# EAGLE design AudioProcessor (EAGLE 8.3.2)

## Sheet 1 of 2
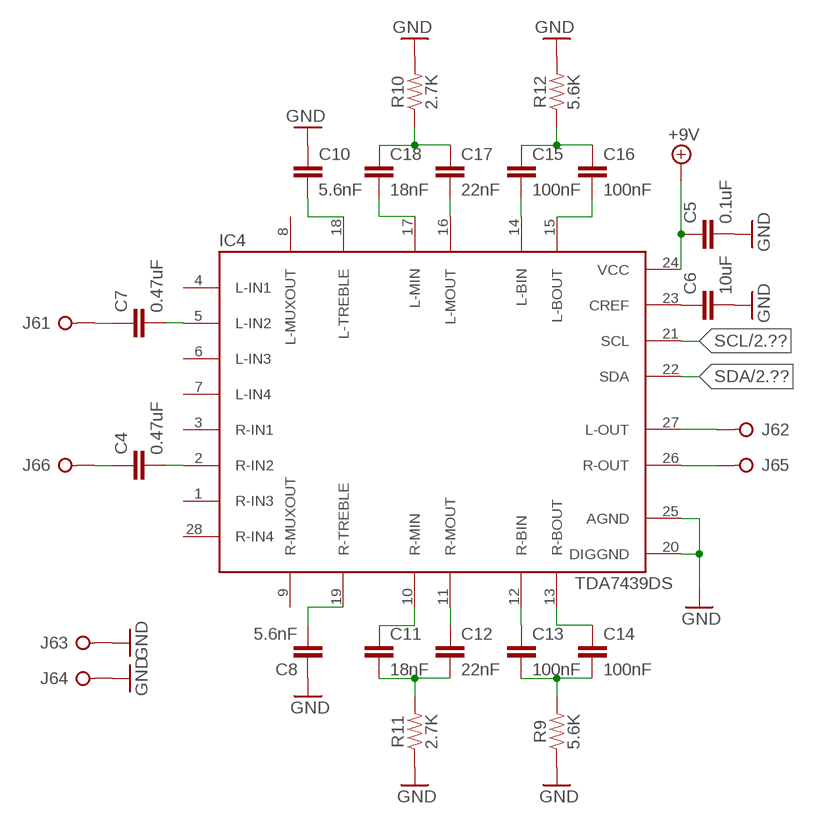
[diagram p0: schematic, sheet 1]

### Parts
C4  0.47uF  CAPACITOR-5MM  [CAPACITOR-5MM]
C5  0.1uF  CAPACITOR-0603  [CAPACITOR-0603]
C6  10uF  CAPACITOR-1206  [CAPACITOR-1206]
C7  0.47uF  CAPACITOR-5MM  [CAPACITOR-5MM]
C8  5.6nF  CAPACITOR-5MM  [CAPACITOR-5MM]
C10  5.6nF  CAPACITOR-5MM  [CAPACITOR-5MM]
C11  18nF  CAPACITOR-5MM  [CAPACITOR-5MM]
C12  22nF  CAPACITOR-5MM  [CAPACITOR-5MM]
C13  100nF  CAPACITOR-5MM  [CAPACITOR-5MM]
C14  100nF  CAPACITOR-5MM  [CAPACITOR-5MM]
C15  100nF  CAPACITOR-5MM  [CAPACITOR-5MM]
C16  100nF  CAPACITOR-5MM  [CAPACITOR-5MM]
C17  22nF  CAPACITOR-5MM  [CAPACITOR-5MM]
C18  18nF  CAPACITOR-5MM  [CAPACITOR-5MM]
IC4  TDA7439DS  [SO-28W]
J6  PINHD-1X6-JST-PH  [JST-B6B-PH]
R9  5.6K  RESISTOR-0805  [RESISTOR-0805]
R10  2.7K  RESISTOR-0805  [RESISTOR-0805]
R11  2.7K  RESISTOR-0805  [RESISTOR-0805]
R12  5.6K  RESISTOR-0805  [RESISTOR-0805]

### Nets
+9V: C5.1 IC4.24(VCC) ; also sheet 2
GND: C5.2 C6.2 C8.1 C10.1 IC4.20(DIGGND) IC4.25(AGND) J6.3 J6.4 R9.1 R10.2 R11.1 R12.2 ; also sheet 2
L-IN: C7.2 IC4.5(L-IN2)
L-IN-RAW: C7.1 J6.1
L-OUT: IC4.27(L-OUT) J6.2
N$1: C10.2 IC4.18(L-TREBLE)
N$3: C18.2 IC4.17(L-MIN)
N$4: C17.2 IC4.16(L-MOUT)
N$5: C17.1 C18.1 R10.1
N$6: C15.2 IC4.14(L-BIN)
N$7: C16.2 IC4.15(L-BOUT)
N$8: C15.1 C16.1 R12.1
N$9: C8.2 IC4.19(R-TREBLE)
N$10: C11.1 IC4.10(R-MIN)
N$11: C12.1 IC4.11(R-MOUT)
N$12: C11.2 C12.2 R11.2
N$13: C13.2 C14.2 R9.2
N$14: C14.1 IC4.13(R-BOUT)
N$15: C13.1 IC4.12(R-BIN)
N$16: C6.1 IC4.23(CREF)
R-IN: C4.2 IC4.2(R-IN2)
R-IN-RAW: C4.1 J6.6
R-OUT: IC4.26(R-OUT) J6.5
SCL: IC4.21(SCL) ; also sheet 2
SDA: IC4.22(SDA) ; also sheet 2
Unconnected: IC4.1(R-IN3) IC4.3(R-IN1) IC4.4(L-IN1) IC4.6(L-IN3) IC4.7(L-IN4) IC4.8(L-MUXOUT) IC4.9(R-MUXOUT) IC4.28(R-IN4)

## Sheet 2 of 2
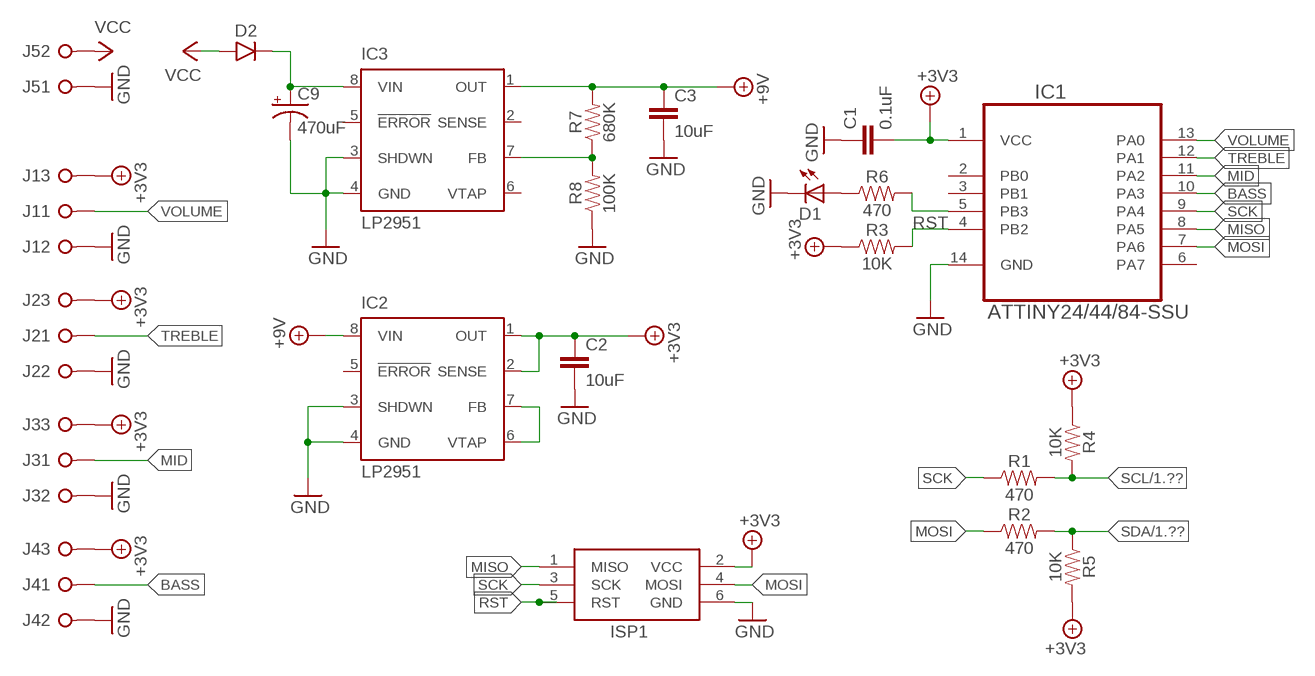
[diagram p1: schematic, sheet 2]

### Parts
C1  0.1uF  CAPACITOR-0603  [CAPACITOR-0603]
C2  10uF  CAPACITOR-1206  [CAPACITOR-1206]
C3  10uF  CAPACITOR-1206  [CAPACITOR-1206]
C9  470uF  CAPACITOR-POLARIZED-3.5-8  [CAP-POL-3.5-8]
D1  LED-0805  [LED-0805]
D2  DIODE-DO214AC  [DO-214AC]
IC1  ATTINY24/44/84-SSU  [SO-14]
IC2  LP2951  [SOIC-08]
IC3  LP2951  [SOIC-08]
ISP1  ICSP-HEADER-6  [ICSP-HEADER]
J1  PINHD-1X3-JST-PH  [JST-B3B-PH]
J2  PINHD-1X3-JST-PH  [JST-B3B-PH]
J3  PINHD-1X3-JST-PH  [JST-B3B-PH]
J4  PINHD-1X3-JST-PH  [JST-B3B-PH]
J5  PINHD-1X2-JST-PH  [JST-B2B-PH]
R1  470  RESISTOR-0805  [RESISTOR-0805]
R2  470  RESISTOR-0805  [RESISTOR-0805]
R3  10K  RESISTOR-0805  [RESISTOR-0805]
R4  10K  RESISTOR-0805  [RESISTOR-0805]
R5  10K  RESISTOR-0805  [RESISTOR-0805]
R6  470  RESISTOR-0805  [RESISTOR-0805]
R7  680K  RESISTOR-0805  [RESISTOR-0805]
R8  100K  RESISTOR-0805  [RESISTOR-0805]

### Nets
+3V3: C1.2 C2.1 IC1.1(VCC) IC2.1(OUT) IC2.2(SENSE) ISP1.2(VCC) J1.3 J2.3 J3.3 J4.3 R3.1 R4.1 R5.2
+9V: C3.1 IC2.8(VIN) IC3.1(OUT) R7.2 ; also sheet 1
BASS: IC1.10(PA3) J4.1
GND: C1.1 C2.2 C3.2 C9.- D1.2(C) IC1.14(GND) IC2.3(SHDWN) IC2.4(GND) IC3.3(SHDWN) IC3.4(GND) ISP1.6(GND) J1.2 J2.2 J3.2 J4.2 J5.1 R8.1 ; also sheet 1
LED: IC1.5(PB3) R6.2
MID: IC1.11(PA2) J3.1
MISO: IC1.8(PA5) ISP1.1(MISO)
MOSI: IC1.7(PA6) ISP1.4(MOSI) R2.1
N$2: D1.1(A) R6.1
N$17: IC3.7(FB) R7.1 R8.2
N$18: C9.+ D2.2(-) IC3.8(VIN)
N$19: IC2.6(VTAP) IC2.7(FB)
RST: IC1.4(PB2) ISP1.5(RST) R3.2
SCK: IC1.9(PA4) ISP1.3(SCK) R1.1
SCL: R1.2 R4.2 ; also sheet 1
SDA: R2.2 R5.1 ; also sheet 1
TREBLE: IC1.12(PA1) J2.1
VCC: D2.1(+) J5.2
VOLUME: IC1.13(PA0) J1.1
Unconnected: IC1.2(PB0) IC1.3(PB1) IC1.6(PA7) IC2.5(!ERROR) IC3.2(SENSE) IC3.5(!ERROR) IC3.6(VTAP)

## Library data of the parts
C1-C8 C10-C18 = SaintGimp:CAPACITOR: Ceramic Capacitor
C9 = SaintGimp:CAPACITOR-POLARIZED: Polarized Capacitor
D1 = SaintGimp:LED-*
D2 = SaintGimp:DIODE
IC1 = SaintGimp:ATTINY24/44/84: 8-bit Microcontroller with In-System Programmable Flash
IC2 IC3 = SaintGimp:LP2951
IC4 = SaintGimp:TDA7439DS
ISP1 = SaintGimp:ICSP-HEADER: ICSP HEADER Standard 6 pin header for ICSP programming
J1-J4 = SaintGimp:PINHD-1X3: PIN HEADER
J5 = SaintGimp:PINHD-1X2
J6 = SaintGimp:PINHD-1X6
R1-R12 = SaintGimp:RESISTOR-*

## Board
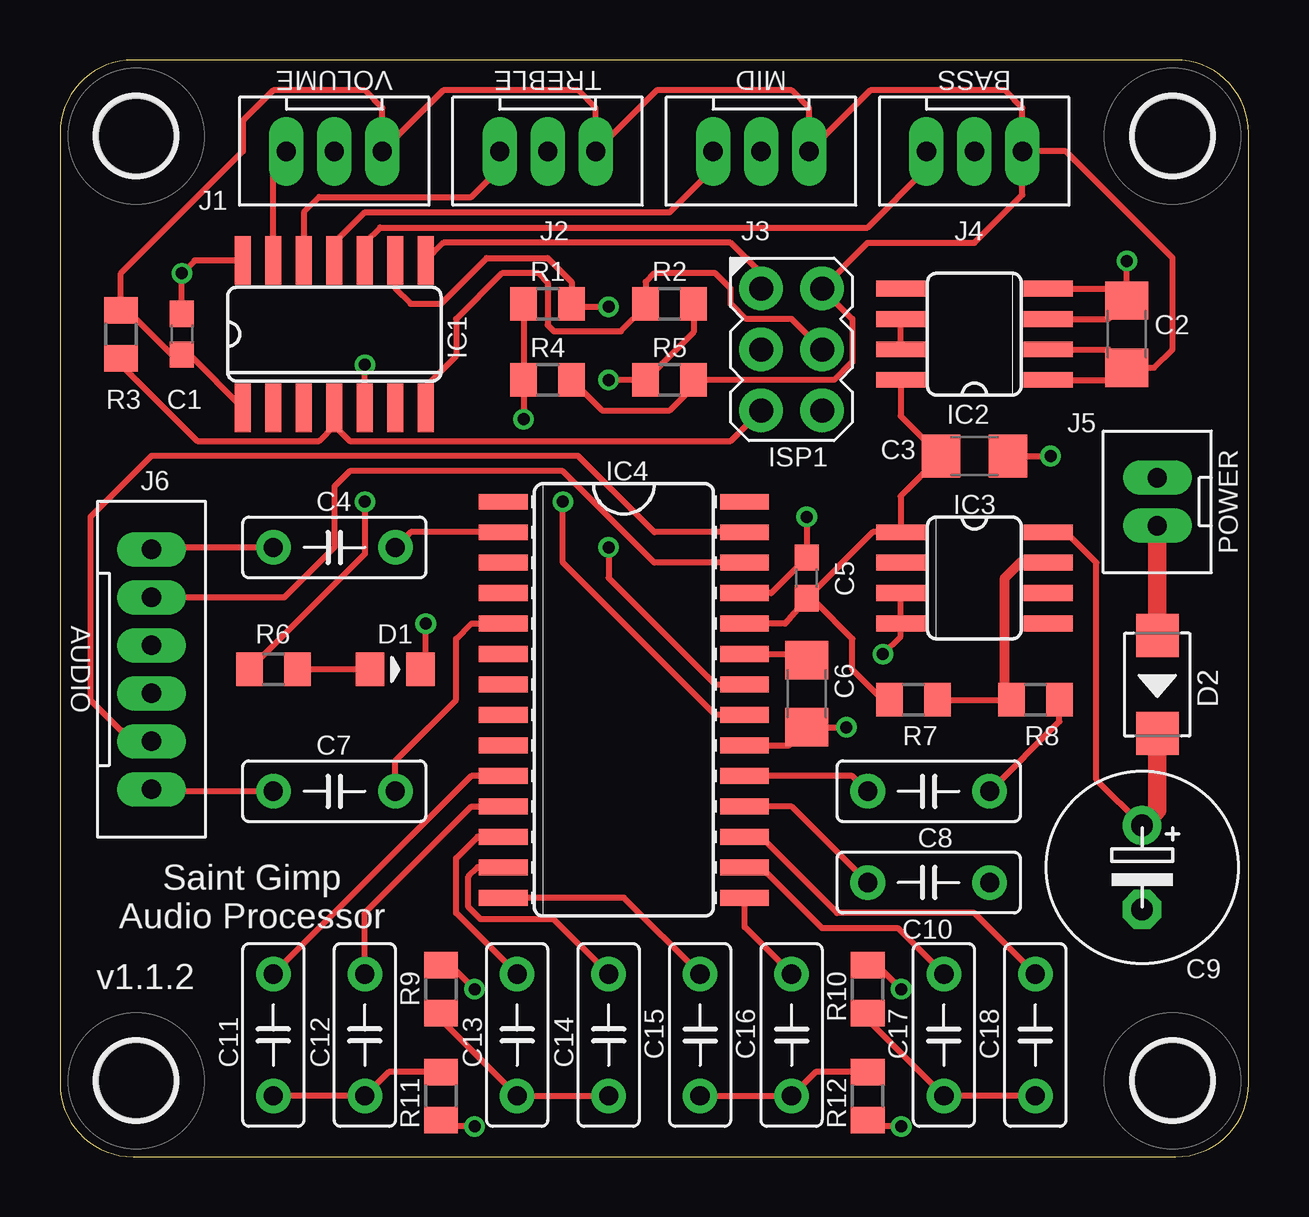
[diagram p2: board, top side]
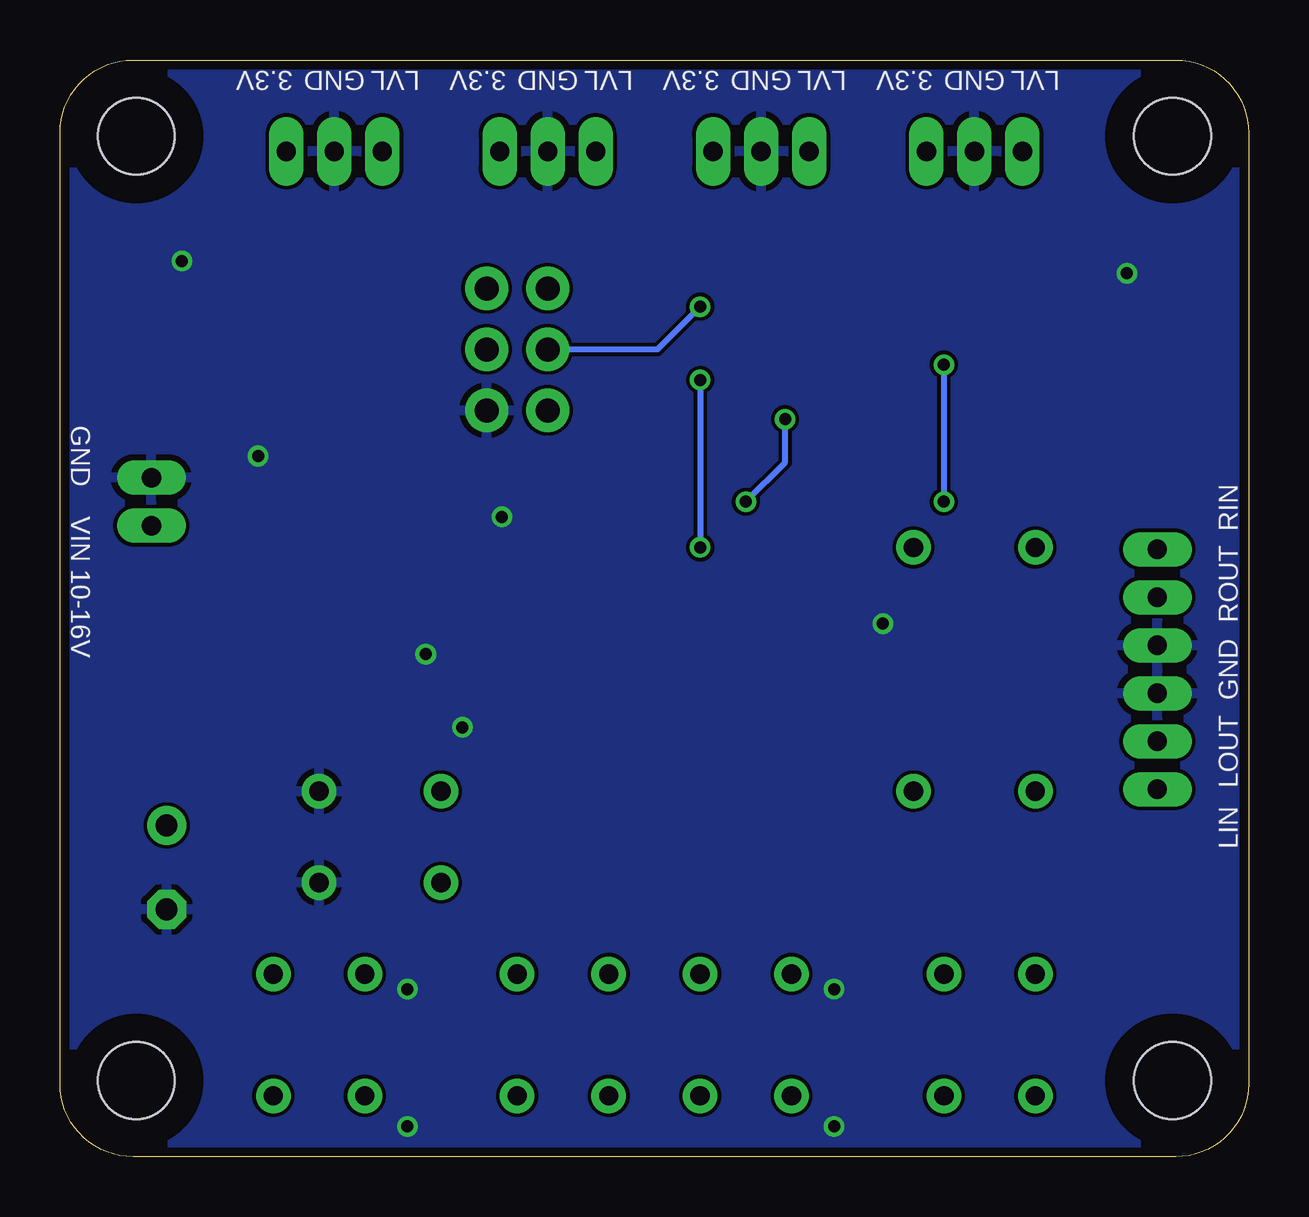
[diagram p3: board, bottom side, seen from below]

Size 49.53 x 45.72 mm. Coordinates in mm from the lower left corner, seen from the top.
Outline: 0,42.67 0,3.05 arc90 3.05,0 46.48,0 arc90 49.53,3.05 49.53,42.67 arc90 46.48,45.72 3.05,45.72 arc90 0,42.67
Copper layers (1*16): Top 0.0356mm / dielectric 1.5011mm / Bottom 0.0356mm
Design rules "Saintgimp-OSHPark": minimum track width 10mil, minimum drill 13mil, track to track 6mil, track to pad 6mil, pad to pad 6mil, via to via 6mil, smd to smd 6mil, copper to edge 15mil, drill to drill 6mil, minimum pad ring 12mil, minimum via ring 7mil, stop-mask expansion 2mil, vias tented up to drill 24mil, thermal gap 10mil

### Footprints (pad centres in the part's own frame; a part is rotated, then mirrored left to right if it is on the bottom)
CAPACITOR-0603 = smd 1.1 x 1: 1 -0.85,0; 2 0.85,0
CAPACITOR-1206 = smd 1.6 x 1.8: 1 -1.4,0; 2 1.4,0
CAPACITOR-5MM = drill 0.8: 1 -2.54,0; 2 2.54,0
CAP-POL-3.5-8 = drill 0.9: + -1.75,0 | drill 0.9 octagon: - 1.75,0
LED-0805 = smd 1.194 x 1.4: 1 -1.047,0; 2 1.047,0
DO-214AC = smd 1.8 x 1.77: 1 -2.042,0; 2 2.042,0
SO-14 = smd 0.66 x 2.032: 1 -3.81,-3.073; 2 -2.54,-3.073; 3 -1.27,-3.073; 4 0,-3.073; 5 1.27,-3.073; 6 2.54,-3.073; 7 3.81,-3.073; 8 3.81,3.073; 9 2.54,3.073; 10 1.27,3.073; 11 0,3.073; 12 -1.27,3.073; 13 -2.54,3.073; 14 -3.81,3.073
SOIC-08 = smd 0.66 x 2.032: 1 -1.905,-3.073; 2 -0.635,-3.073; 3 0.635,-3.073; 4 1.905,-3.073; 5 1.905,3.073; 6 0.635,3.073; 7 -0.635,3.073; 8 -1.905,3.073
SO-28W = smd 0.66 x 2.032: 1 -8.255,-5.029; 2 -6.985,-5.029; 3 -5.715,-5.029; 4 -4.445,-5.029; 5 -3.175,-5.029; 6 -1.905,-5.029; 7 -0.635,-5.029; 8 0.635,-5.029; 9 1.905,-5.029; 10 3.175,-5.029; 11 4.445,-5.029; 12 5.715,-5.029; 13 6.985,-5.029; 14 8.255,-5.029; 15 8.255,5.029; 16 6.985,5.029; 17 5.715,5.029; 18 4.445,5.029; 19 3.175,5.029; 20 1.905,5.029; 21 0.635,5.029; 22 -0.635,5.029; 23 -1.905,5.029; 24 -3.175,5.029; 25 -4.445,5.029; 26 -5.715,5.029; 27 -6.985,5.029; 28 -8.255,5.029
ICSP-HEADER = drill 1: 1 -1.27,2.54; 2 1.27,2.54; 3 -1.27,0; 4 1.27,0; 5 -1.27,-2.54; 6 1.27,-2.54
JST-B3B-PH = drill 0.8 long: 1 2,0; 2 0,0; 3 -2,0
JST-B2B-PH = drill 0.8 long: 1 1,0; 2 -1,0
JST-B6B-PH = drill 0.8 long: 1 5,0; 2 3,0; 3 1,0; 4 -1,0; 5 -3,0; 6 -5,0
RESISTOR-0805 = smd 1.1 x 1.4: 1 -1,0; 2 1,0
MOUNTING-HOLE-3.2MM = hole 3.2: 0,0

### Placement (x,y rotation side)
C1  5.08,34.29 270 top
C2  44.45,34.29 90 top
C3  38.1,29.21 0 top
C4  11.43,25.4 0 top
C5  31.11,24.13 90 top
C6  31.11,19.3 270 top
C7  11.43,15.24 0 top
C8  36.2,15.24 180 top
C9  45.09,12.06 270 top
C10  36.2,11.43 180 top
C11  8.89,5.08 270 top
C12  12.7,5.08 270 top
C13  19.05,5.08 270 top
C14  22.86,5.08 270 top
C15  26.67,5.08 90 top
C16  30.48,5.08 90 top
C17  36.83,5.08 90 top
C18  40.64,5.08 90 top
D1  13.97,20.32 0 top
D2  45.72,19.68 270 top
IC1  11.43,34.29 0 top
IC2  38.1,34.29 90 top
IC3  38.1,24.13 270 top
IC4  23.5,19.05 270 top
ISP1  30.48,33.66 0 top
J1  11.43,41.91 180 top
J2  20.32,41.91 180 top
J3  29.21,41.91 180 top
J4  38.1,41.91 180 top
J5  45.72,27.3 90 top
J6  3.81,20.32 270 top
R1  20.32,35.56 180 top
R2  25.4,35.56 0 top
R3  2.54,34.29 270 top
R4  20.32,32.38 180 top
R5  25.4,32.38 0 top
R6  8.89,20.32 180 top
R7  35.56,19.05 180 top
R8  40.64,19.05 180 top
R9  15.88,6.99 270 top
R10  33.66,6.99 90 top
R11  15.88,2.54 90 top
R12  33.66,2.54 270 top
U$1  [MOUNTING-HOLE-3.2MM]  3.17,42.55 0 top
U$2  [MOUNTING-HOLE-3.2MM]  46.35,42.55 0 top
U$3  [MOUNTING-HOLE-3.2MM]  3.17,3.17 0 top
U$4  [MOUNTING-HOLE-3.2MM]  46.35,3.17 0 top

### Tracks (layer width: path | path; a pad name or v marks a point on that pad's centre or on a via)
+3V3
  Top 0.254: C2.1 44.45,32.38 IC2.1 41.91,32.38 | IC2.2 43.69,33.66 C2.1 | R4.1 22.59,31.11 25.4,31.11 26.4,32.12 R5.2 32.26,32.38 33.02,33.15 33.02,34.92 ISP1.2 33.66,38.1 38.1,38.1 40.1,40.1 J4.3 | C2.1 45.59,32.89 46.35,33.66 46.35,37.47 41.91,41.91 J4.3 | J4.3 40.1,43.72 39.37,44.45 33.75,44.45 J3.3 31.21,43.72 30.48,44.45 24.86,44.45 J2.3 22.32,43.72 21.59,44.45 15.97,44.45 J1.3 13.43,43.72 12.7,44.45 8.89,44.45 7.62,43.18 7.62,41.91 2.54,36.83 2.54,35.56 | 2.54,35.56 R3.1 | 2.54,35.56 4.66,33.44 C1.2 5.4,33.44 IC1.1
+9V
  Top 0.254: C5.1 30.21,22.23 IC4.24 | R7.2 34.29,19.05 33.02,20.32 33.02,21.59 31.48,23.13 C5.1 | IC2.8 35.03,30.88 C3.1 35.03,27.54 IC3.1 33.87,26.04 C5.1
BASS
  Top 0.254: IC1.10 12.7,38.1 13.34,38.73 33.66,38.73 36.1,41.18 J4.1
GND  (via drill 0.5)
  Top 0.254: v31.11,26.67 C5.2 29.63,23.5 IC4.25 | v17.27,1.27 16.14,1.27 R11.1 | 44.45,36.2 C2.2 43.69,34.92 IC2.3 | 44.45,36.2 v44.45,37.34 | C1.1 v5.08,36.83 5.61,37.36 IC1.14 | C3.2 v41.27,29.21 | v34.29,20.95 35.03,21.69 IC3.4 IC3.3 | 16.4,7.99 R9.1 16.27,7.99 v17.27,6.99 | IC2.4 44.45,36.2 | v35.05,6.99 34.05,7.99 R10.2 | v35.05,1.27 33.92,1.27 R12.2 | IC4.20 30.36,17.14 C6.2 v32.76,17.9 v32.77,17.91 | D1.2 15.24,20.54 v15.24,22.23 | C8.1 41.64,18.14 R8.1
  pour Bottom: 0,45.72 49.53,45.72 49.53,0 0,0
L-IN
  Top 0.254: C7.2 13.97,16.51 16.51,19.05 16.51,21.59 17.14,22.23 IC4.5
L-IN-RAW
  Top 0.254: C7.1 3.89,15.24 J6.1
L-OUT
  Top 0.254: IC4.27 24.77,26.04 21.59,29.21 3.81,29.21 1.27,26.67 1.27,19.05 2.54,17.78 3.35,17.78 J6.2
LED  (via drill 0.5)
  Top 0.254: IC1.5 v12.7,33.02 | v12.7,27.3 12.7,25.13 R6.2
  Bottom 0.254: v12.7,33.02 v12.7,27.3
MID
  Top 0.254: IC1.11 11.43,38.1 12.7,39.37 25.4,39.37 27.21,41.18 J3.1
MISO
  Top 0.254: ISP1.1 29.21,36.83 27.94,38.1 15.98,38.1 IC1.8
MOSI
  Top 0.254: IC1.7 15.24,32.12 16.51,33.38 16.51,34.92 18.41,36.83 19.94,36.83 20.32,36.45 20.32,34.67 20.57,34.42 23.37,34.42 24.4,35.45 R2.1 24.4,36.47 24.77,36.83 27.3,36.83 27.94,36.2 27.94,35.56 28.57,34.92 30.48,34.92 ISP1.4
N$1
  Top 0.254: C10.2 30.48,14.61 IC4.18
N$2
  Top 0.254: D1.1 R6.1
N$3
  Top 0.254: C18.2 38.1,10.16 32.38,10.16 29.21,13.34 IC4.17
N$4
  Top 0.254: C17.2 34.92,9.53 31.75,9.53 29.21,12.06 IC4.16
N$5
  Top 0.254: R10.1 33.66,5.71 C17.1 C18.1
N$6
  Top 0.254: C15.2 23.5,10.79 IC4.14
N$7
  Top 0.254: C16.2 28.52,9.58 IC4.15
N$8
  Top 0.254: C15.1 C16.1 31.48,3.54 R12.1
N$9
  Top 0.254: C8.2 33.02,15.88 IC4.19
N$10
  Top 0.254: IC4.10 17.14,15.88 C11.1
N$11
  Top 0.254: C12.1 12.7,10.16 17.14,14.61 IC4.11
N$12
  Top 0.254: R11.2 13.7,3.54 C12.2 C11.2
N$13
  Top 0.254: R9.2 15.88,5.71 C13.2 C14.2
N$14
  Top 0.254: C14.1 20.57,9.91 17.53,9.91 17.02,10.41 17.02,11.68 17.4,12.06 IC4.13
N$15
  Top 0.254: C13.1 16.51,10.16 16.51,12.45 17.4,13.34 IC4.12
N$16
  Top 0.254: IC4.23 30.86,20.95 C6.1
N$17
  Top 0.254: R7.1 R8.2
  Top 0.406: R8.2 39.37,19.32 39.37,24.13 40.01,24.77 IC3.7
N$18
  Top 0.254: C9.+ 43.18,15.72 43.18,24.77 41.91,26.04 IC3.8
  Top 0.762: D2.2 45.72,14.45 C9.+
N$19
  Top 0.254: IC2.7 IC2.6
R-IN
  Top 0.254: IC4.2 14.61,26.04 C4.2
R-IN-RAW
  Top 0.254: C4.1 3.89,25.4 J6.6
R-OUT
  Top 0.254: IC4.26 24.77,24.77 20.95,28.57 12.06,28.57 11.43,27.94 11.43,25.4 9.35,23.32 J6.5
RST
  Top 0.254: 11.43,30.48 12.06,29.84 27.94,29.84 ISP1.5 | 11.43,30.48 IC1.4 | R3.2 2.54,33.02 5.71,29.84 10.79,29.84 11.43,30.48
SCK  (via drill 0.5)
  Top 0.254: v22.86,35.43 21.45,35.43 R1.1 21.32,36.47 20.32,37.47 17.78,37.47 15.88,35.56 14.61,35.56 13.97,36.2 IC1.9
  Bottom 0.254: v22.86,35.43 24.64,33.66 ISP1.3
SCL  (via drill 0.5)
  Top 0.254: R1.2 R4.2 v19.32,30.75 | IC4.21 27.3,18.41 20.95,24.77 v20.95,27.3
  Bottom 0.254: v20.95,27.3 19.32,28.94 v19.32,30.75
SDA  (via drill 0.5)
  Top 0.254: R2.2 26.4,34.38 R5.1 v22.86,32.38 | v22.86,25.4 22.86,24.13 27.3,19.68 IC4.22
  Bottom 0.254: v22.86,32.38 v22.86,25.4
TREBLE
  Top 0.254: IC1.12 10.16,39.37 10.79,40.01 17.14,40.01 18.32,41.18 J2.1
VCC
  Top 0.762: D2.1 J5.2
VOLUME
  Top 0.254: IC1.13 8.89,41.37 J1.1

### Text on the board
tPlace: VOLUME | TREBLE | MID | BASS | POWER | AUDIO | Saint Gimp / Audio Processor | v1.1.2
bPlace: LVL | GND | 3.3V | LVL | GND | 3.3V | LVL | GND | 3.3V | LVL | GND | 3.3V | GND | RIN | ROUT | VIN 10-16V | GND | LOUT | LIN